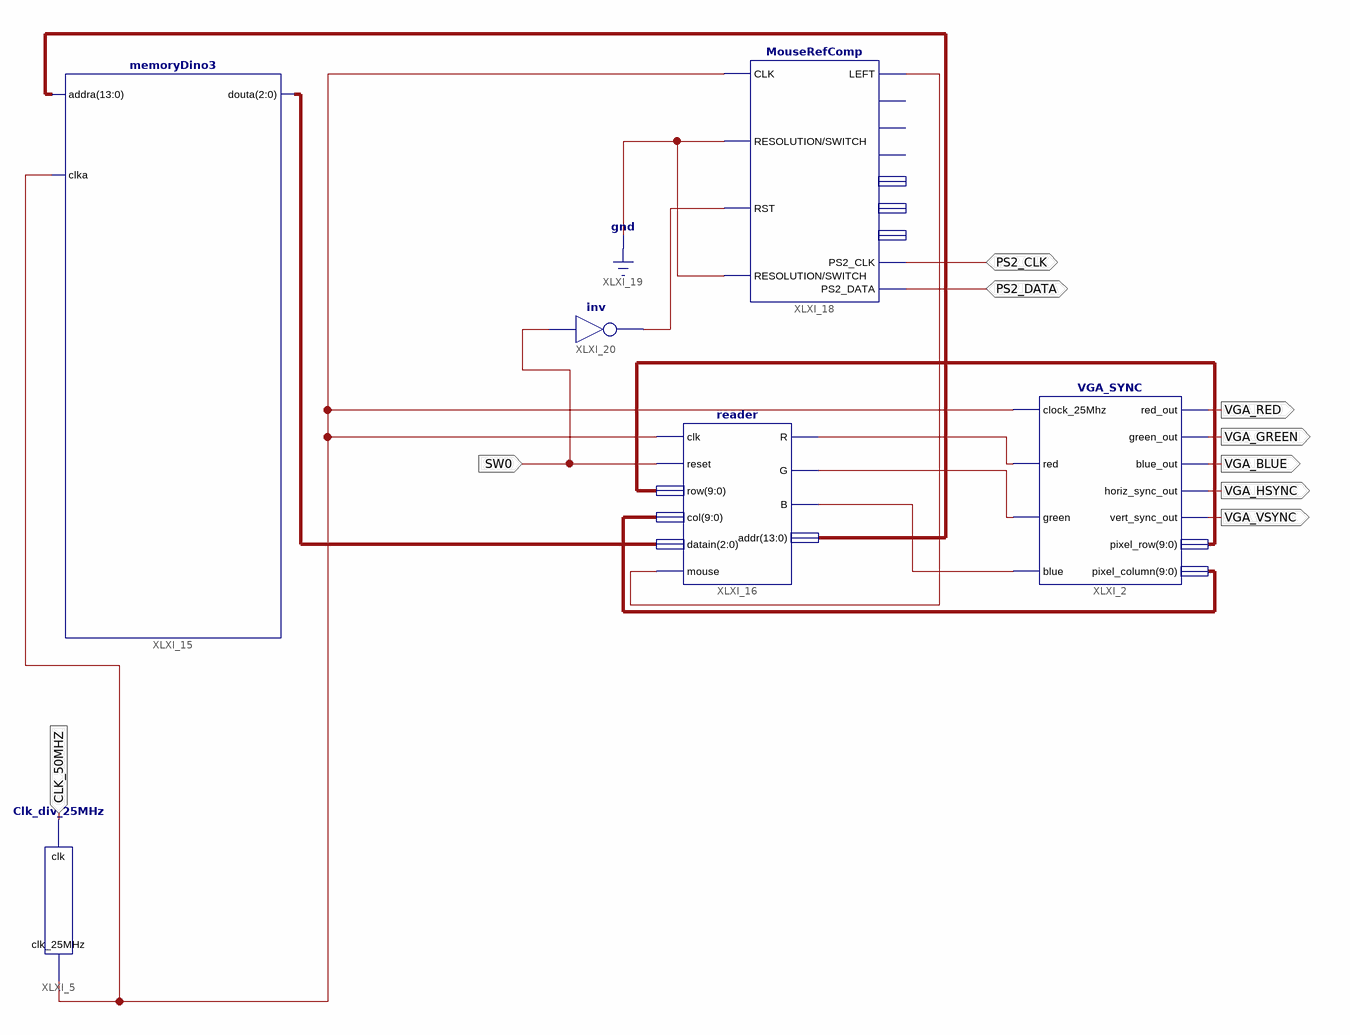
[diagram p0: schematic sheet 1]
// Xilinx ISE schematic VGA_Image_tets.sch (spartan3e) as structural Verilog: 6 symbols, 9 ports
module VGA_Image_tets (
  input  CLK_50MHZ,
  input  SW0,
  inout  PS2_DATA,
  inout  PS2_CLK,
  output VGA_RED,
  output VGA_GREEN,
  output VGA_BLUE,
  output VGA_HSYNC,
  output VGA_VSYNC
);

  wire XLXN_47, XLXN_48, XLXN_49, XLXN_78, XLXN_81, XLXN_87;
  wire [2:0] XLXN_53;
  wire [9:0] XLXN_54, XLXN_55;
  wire [13:0] XLXN_52;

  VGA_SYNC XLXI_2 (
    .clock_25Mhz(XLXN_87), .red(XLXN_47), .green(XLXN_48), .blue(XLXN_49), .red_out(VGA_RED),
    .green_out(VGA_GREEN), .blue_out(VGA_BLUE), .horiz_sync_out(VGA_HSYNC), .vert_sync_out(VGA_VSYNC),
    .pixel_row(XLXN_54), .pixel_column(XLXN_55));
  Clk_div_25MHz XLXI_5 (.clk(CLK_50MHZ), .clk_25MHz(XLXN_87));
  memoryDino3 XLXI_15 (.addra(XLXN_52), .clka(XLXN_87), .douta(XLXN_53));
  reader XLXI_16 (
    .clk(XLXN_87), .reset(SW0), .mouse(XLXN_78), .row(XLXN_54), .col(XLXN_55), .datain(XLXN_53), .R(XLXN_47),
    .G(XLXN_48), .B(XLXN_49), .addr(XLXN_52));
  MouseRefComp XLXI_18 (
    .CLK(XLXN_87), .RESOLUTION(1'b0), .RST(XLXN_81), .SWITCH(1'b0), .LEFT(XLXN_78), .PS2_CLK(PS2_CLK),
    .PS2_DATA(PS2_DATA));  // open: MIDDLE, NEW_EVENT, RIGHT, XPOS, YPOS, ZPOS
  not XLXI_20 (XLXN_81, SW0);
endmodule
